# EAGLE design DDS-Gen (EAGLE 8.0.2)
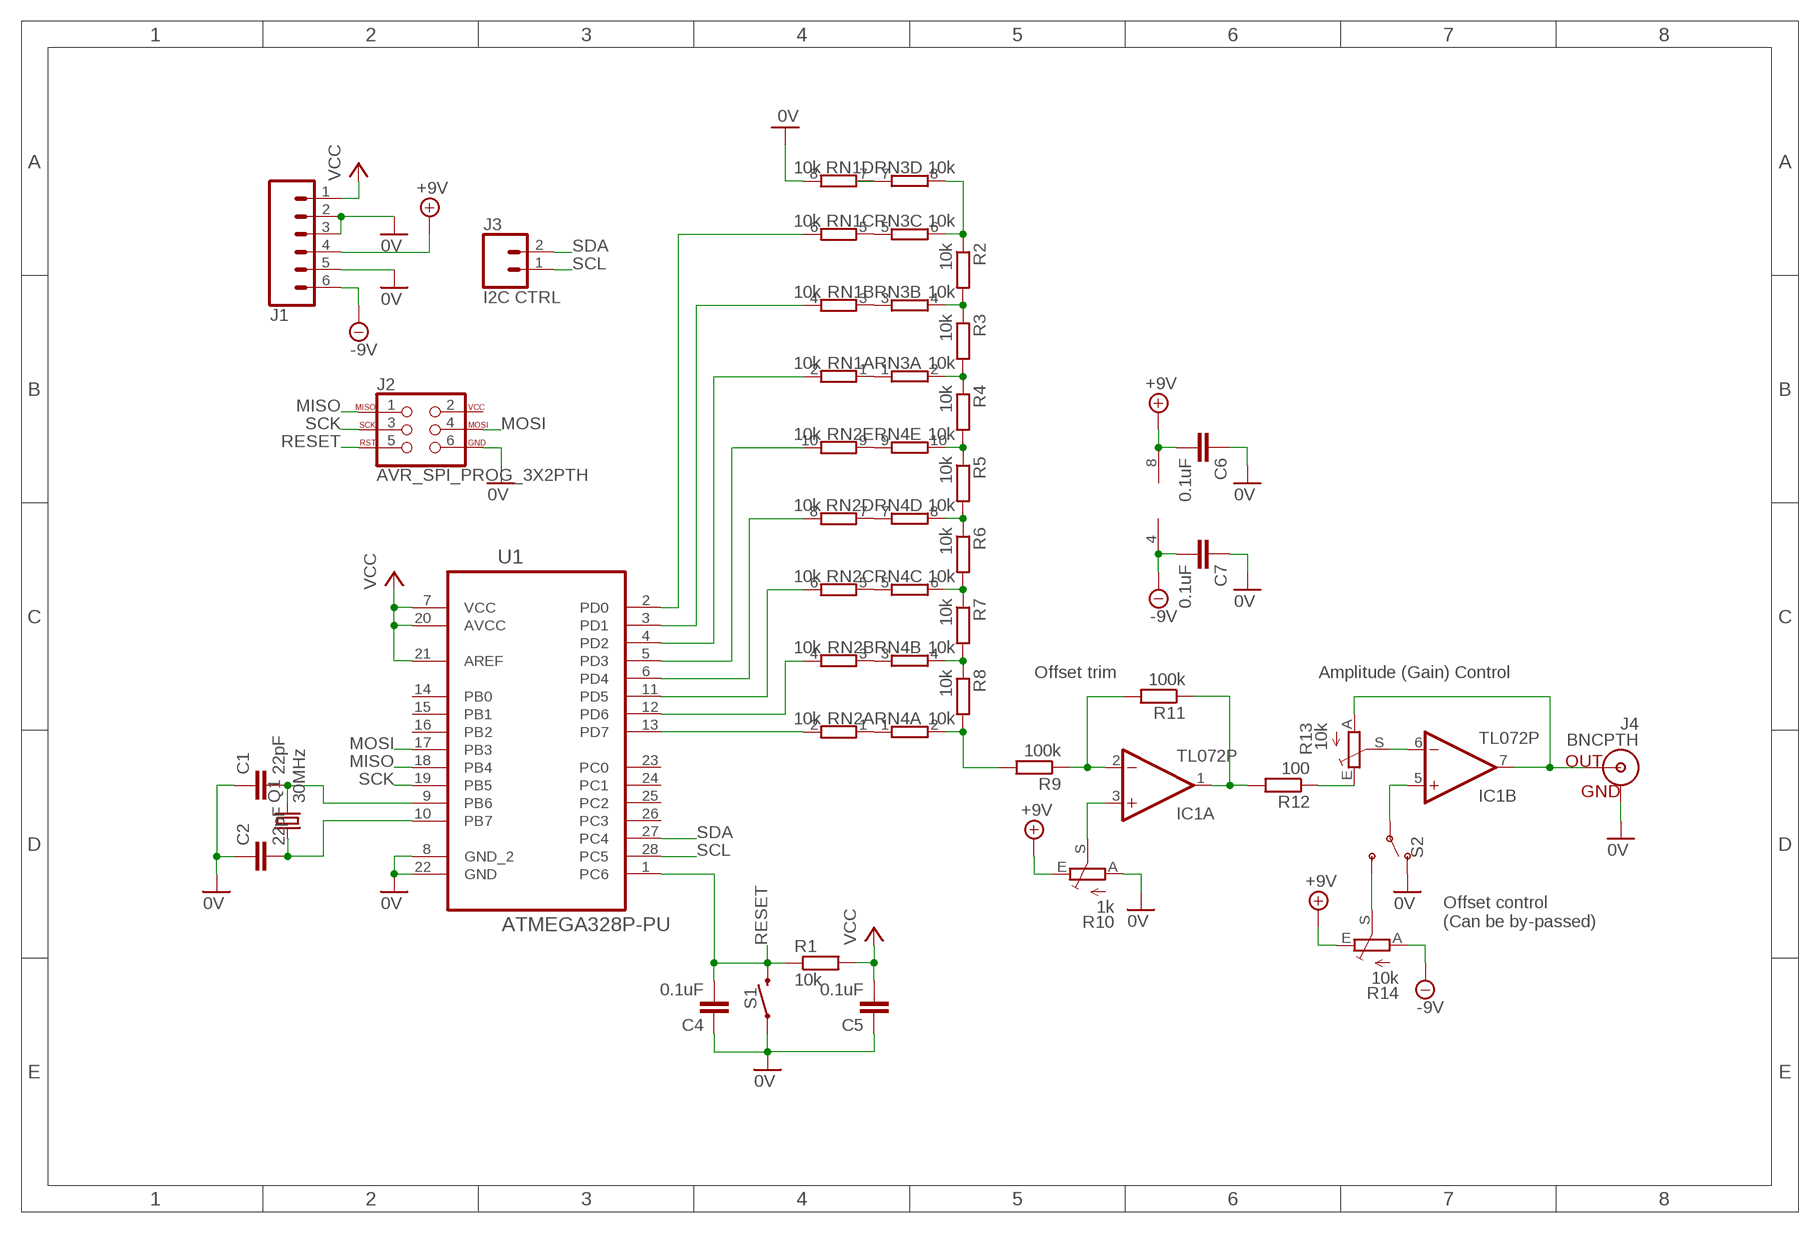
[diagram p0: schematic, sheet 1]

## Parts
C1  22pF  C-EU025-025X050  [C025-025X050]
C2  22pF  C-EU025-025X050  [C025-025X050]
C4  0.1uF  C-EU025-025X050  [C025-025X050]
C5  0.1uF  C-EU025-025X050  [C025-025X050]
C6  0.1uF  C-EU025-025X050  [C025-025X050]
C7  0.1uF  C-EU025-025X050  [C025-025X050]
IC1  TL072P  [DIL08]
J1  CONN_06POLAR  [MOLEX-1X6]
J2  AVR_SPI_PROG_3X2PTH  [2X3]
J3  I2C CTRL  CONN_02POLAR  [MOLEX-1X2]
J4  BNCPTH  [BNC]
Q1  30MHz  CRYSTALHC49S  [HC49/S]
R1  10k  R-EU_0204/5  [0204/5]
R2  10k  R-EU_0204/5  [0204/5]
R3  10k  R-EU_0204/5  [0204/5]
R4  10k  R-EU_0204/5  [0204/5]
R5  10k  R-EU_0204/5  [0204/5]
R6  10k  R-EU_0204/5  [0204/5]
R7  10k  R-EU_0204/5  [0204/5]
R8  10k  R-EU_0204/5  [0204/5]
R9  100k  R-EU_0204/5  [0204/5]
R10  1k  TRIM_EU-S64W  [S64W]
R11  100k  R-EU_0204/2V  [0204V]
R12  100  R-EU_0207/12  [0207/12]
R13  10k  TRIM_EU-CIP20C-6MM  [CIP20C-6MM]
R14  10k  TRIM_EU-CIP20C-6MM  [CIP20C-6MM]
RN1  10k  E5R  [SIL10]
RN2  10k  E5R  [SIL10]
RN3  10k  E5R  [SIL10]
RN4  10k  E5R  [SIL10]
S1  MOMENTARY-SWITCH-SPST-PTH-6.0MM  [TACTILE_SWITCH_PTH_6.0MM]
S2  SWITCH-SPDT-PTH-11.6X4.0MM  [SWITCH_SPDT_PTH_11.6X4.0MM]
U1  ATMEGA328P-PU  [DIP254P762X457-28]

## Nets
0V: C1.1 C2.1 C4.1 C5.1 C6.1 C7.1 J1.2 J1.3 J1.5 J2.6 J4.GND R10.A RN1.8 S1.1 S2.1(O) U1.8(GND_2) U1.22(GND)
+9V: C6.2 IC1.8(P:V+) J1.4 R10.E R14.E
-9V: C7.2 IC1.4(P:V-) J1.6 R14.A
MISO: J2.1 U1.18(PB4)
MOSI: J2.4 U1.17(PB3)
N$1: C2.2 Q1.1 U1.10(PB7)
N$2: C1.2 Q1.2 U1.9(PB6)
N$3: IC1.3(A:+IN) R10.S
N$4: IC1.2(A:-IN) R9.1 R11.2
N$5: RN2.2 U1.13(PD7)
N$6: RN2.4 U1.12(PD6)
N$7: RN2.6 U1.11(PD5)
N$8: RN2.8 U1.6(PD4)
N$9: RN2.10 U1.5(PD3)
N$10: RN1.2 U1.4(PD2)
N$11: RN1.4 U1.3(PD1)
N$12: RN1.6 U1.2(PD0)
N$13: IC1.5(B:+IN) S2.2(P)
N$15: R14.S S2.3(S)
N$16: R12.1 R13.E
N$21: IC1.1(A:OUT) R11.1 R12.2
N$22: IC1.6(B:-IN) R13.S
N$23: IC1.7(B:OUT) J4.S(OUT) R13.A
N$25: RN2.1 RN4.1
N$26: RN2.3 RN4.3
N$27: RN2.5 RN4.5
N$28: RN2.7 RN4.7
N$29: RN2.9 RN4.9
N$30: RN1.1 RN3.1
N$31: RN1.3 RN3.3
N$32: RN1.5 RN3.5
N$33: RN1.7 RN3.7
N$34: R2.1 RN3.6 RN3.8
N$35: R2.2 R3.1 RN3.4
N$36: R3.2 R4.1 RN3.2
N$37: R4.2 R5.1 RN4.10
N$38: R5.2 R6.1 RN4.8
N$39: R6.2 R7.1 RN4.6
N$40: R7.2 R8.1 RN4.4
N$41: R8.2 R9.2 RN4.2
RESET: C4.2 J2.5 R1.1 S1.3 U1.1(PC6)
SCK: J2.3 U1.19(PB5)
SCL: J3.1 U1.28(PC5)
SDA: J3.2 U1.27(PC4)
VCC: C5.2 J1.1 R1.2 U1.7(VCC) U1.20(AVCC) U1.21(AREF)
Unconnected: J2.2 RN1.9 RN1.10 RN3.9 RN3.10 U1.14(PB0) U1.15(PB1) U1.16(PB2) U1.23(PC0) U1.24(PC1) U1.25(PC2) U1.26(PC3)

## Notes on the sheet
- Offset trim | Amplitude (Gain) Control
- Offset control
  (Can be by-passed)

## Library data of the parts
C1 C2 C4-C7 = rcl:C-EU: CAPACITOR, European symbol
IC1 = linear:TL072: OP AMP
J1 = SparkFun-Connectors:CONN_06: Multi connection point. Often used as Generic Header-pin footprint for 0.1 inch spaced/style header connections On any of the 0.1 inch spaced packages, you can populate with these: Break Away Headers - Straight <https://www.sparkfun.com/products/116> (PRT-00116) Break Away Male Headers - Right Angle <https://www.sparkfun.com/products/553> (PRT-00553) Female Headers <https://www.sparkfun.com/products/115> (PRT-00115) Break Away Headers - Machine Pin <https://www.sparkfun.com/products/117> (PRT-00117) Break Away Female Headers - Swiss Machine Pin <https://www.sparkfun.com/products/743> (PRT-00743) Arduino Stackable Header - 6 Pin <https://www.sparkfun.com/products/9280> (PRT-09280) For SCREWTERMINALS and SPRING TERMINALS visit here: Screw Terimnals on SparkFun.com <https://www.sparkfun.com/search/results?term=Screw+Terminals> (5mm/3.5mm/2.54mm spacing) This device is also useful as a general connection point to wire up your design to another part of your project. Our various solder wires solder well into these plated through hole pads. Hook-Up Wire - Assortment (Stranded, 22 AWG) <https://www.sparkfun.com/products/11375> (PRT-11375) Hook-Up Wire - Assortment (Solid Core, 22 AWG) <https://www.sparkfun.com/products/11367> (PRT-11367) View the entire wire category on our website here <https://www.sparkfun.com/categories/141>
J2 = SparkFun-Connectors:AVR_SPI_PROG_3X2: AVR ISP 6 Pin This is the reduced ISP connector for AVR programming. Common on Arduino. This footprint will take up less PCB space and can be used with a 10-pin to 6-pin adapter such as SKU: BOB-08508 **Special note about "TEST_POINT" package. The stop mask is on the top side, so if you want your programming test points to be on the bottom of your board, make sure to place this package on the bottom side of the board. This also ensure that the orientation to program from the bottom side will be correct. SparkFun Products: SparkFun ISP Pogo Adapter <https://www.sparkfun.com/products/11591> - NS Tiny AVR Programmer <https://www.sparkfun.com/products/11801> -PTH
J3 = SparkFun-Connectors:CONN_02: Multi connection point. Often used as Generic Header-pin footprint for 0.1 inch spaced/style header connections On any of the 0.1 inch spaced packages, you can populate with these: Break Away Headers - Straight <https://www.sparkfun.com/products/116> (PRT-00116) Break Away Male Headers - Right Angle <https://www.sparkfun.com/products/553> (PRT-00553) Female Headers <https://www.sparkfun.com/products/115> (PRT-00115) Break Away Headers - Machine Pin <https://www.sparkfun.com/products/117> (PRT-00117) Break Away Female Headers - Swiss Machine Pin <https://www.sparkfun.com/products/743> (PRT-00743) For SCREWTERMINALS and SPRING TERMINALS visit here: Screw Terimnals on SparkFun.com <https://www.sparkfun.com/search/results?term=Screw+Terminals> (5mm/3.5mm/2.54mm spacing) This device is also useful as a general connection point to wire up your design to another part of your project. Our various solder wires solder well into these plated through hole pads. Hook-Up Wire - Assortment (Stranded, 22 AWG) <https://www.sparkfun.com/products/11375> (PRT-11375) Hook-Up Wire - Assortment (Solid Core, 22 AWG) <https://www.sparkfun.com/products/11367> (PRT-11367) View the entire wire category on our website here <https://www.sparkfun.com/categories/141> Special notes: Molex polarized connector foot print use with: PRT-08233 with associated crimp pins and housings. 2.54_SCREWTERM for use with PRT-10571. 3.5mm Screw Terminal footprints for PRT-08084 5mm Screw Terminal footprints for use with PRT-08432; SF_ID: PRT-09918
J4 = SparkFun-Connectors:BNC: BNC Right Angle Connector Mouser Part# 5227161 SparkFun Products: BNC Connector - Right Angle <https://www.sparkfun.com/products/10550>; PROD_ID: LPA-12729; SF_ID: PRT-10550
Q1 = crystal:CRYSTAL: CRYSTAL; OC_FARNELL: 1667008; OC_NEWARK: unknown
R1-R9 R11 R12 = rcl:R-EU_: RESISTOR, European symbol
R10 R13 R14 = pot:TRIM_EU-: POTENTIOMETER
RN1-RN4 = resistor-sil:E5R: SIL RESISTOR; OC_FARNELL: unknown; OC_NEWARK: unknown
S1 = SparkFun-Switches:MOMENTARY-SWITCH-SPST: Momentary Switch (Pushbutton) - SPST Normally-open (NO) SPST momentary switches (buttons, pushbuttons). Variants PTH-12MM - 12mm square, through-hole Momentary Pushbutton Switch - 12mm Square <https://www.sparkfun.com/products/9190> (COM-09190) PTH-6.0MM, PTH-6.0MM-KIT - 6.0mm square, through-hole Mini Pushbutton Switch <https://www.sparkfun.com/products/97> (COM-00097) KIT package intended for soldering kit's - only one side of pads' copper is exposed. PTH-RIGHT-ANGLE-KIT - Right-angle, through-hole Right Angle Tactile Button <https://www.sparkfun.com/products/10791> - Used on SparkFun BigTime Watch Kit <https://www.sparkfun.com/products/11734> SMD-12MM - 12mm square, surface-mount Tactile Button - SMD (12mm) <https://www.sparkfun.com/products/12993> (COM-12993) Used on SparkFun PicoBoard <https://www.sparkfun.com/products/11888> SMD-4.5MM - 4.5mm Square Trackball Switch Used on SparkFun Blackberry Trackballer Breakout <https://www.sparkfun.com/products/13169> SMD-4.6MMX2.8MM - 4.60mm x 2.80mm, surface mount Used on SparkFun SAMD21 Mini Breakout <https://www.sparkfun.com/products/13664> SMD-5.2MM, SMD-5.2-REDUNDANT - 5.2mm square, surface-mount Mini Pushbutton Switch - SMD <https://www.sparkfun.com/products/8720> (COM-08720) Used on Arduino Pro Mini <https://www.sparkfun.com/products/11114> REDUNDANT package connects both switch circuits together SMD-6.0X3.5MM - 6.0 x 3.5mm, surface mount Momentary Reset Switch SMD <https://www.sparkfun.com/products/8229> (COM-08229) SMD-6.2MM-TALL - 6.2mm square, surface mount Tactile Button - SMD (6mm) <https://www.sparkfun.com/products/12992> Used on SparkFun Digital Sandbox <https://www.sparkfun.com/products/12651> SMD-RIGHT-ANGLE - Right-angle, surface mount Used on SparkFun Block for Intel® Edison - Arduino <https://www.sparkfun.com/products/13036>; PROD_ID: SWCH-08441; SF_SKU: COM-00097
S2 = SparkFun-Switches:SWITCH-SPDT: Single Pole, Double Throw (SPDT) Switch Single-pole, double-throw (SPDT) switch. Variant Overview SMD-AYZ0202 Surface Mount DPDT Switch <https://www.sparkfun.com/products/597> (COM-00597) Used on e.g. LilyPad Arduino USB - ATmega32U4 Board <https://www.sparkfun.com/products/12049> PTH-11.6X4.0MM SPDT Mini Power Switch <https://www.sparkfun.com/products/102> (COM-00102) Used on e.g. SparkFun Simon Says - Through-Hole Soldering Kit <https://www.sparkfun.com/products/10547> (KIT-10547) PTH-11.6X4.0MM-KIT KIT version of SPDT Mini Power Switch - Simplifies soldering by removing tStop of switch pins - only one side can be soldered. PTH-11.6X4.0MM-LOCK LOCK version of SPDT Mini Power Switch - Offset pins hold switch in place for easier soldering. SMD-RIGHT-ANGLE Surface Mount Right Angle Switch <https://www.sparkfun.com/products/10860> (COM-10860) Used on e.g. SparkFun ESP8266 Thing <https://www.sparkfun.com/products/13231>; PROD_ID: SWCH-08261; SF_SKU: COM-00102
U1 = Atmel_By_element14_Batch_1-00:ATMEGA328P-PU: 8-bit Microcontroller with In-System Programmable Flash; MPN: ATMEGA328P-PU; OC_FARNELL: 1715487; OC_NEWARK: 15R0268; PACKAGE: PDIP-28; SUPPLIER: Atmel

## Board
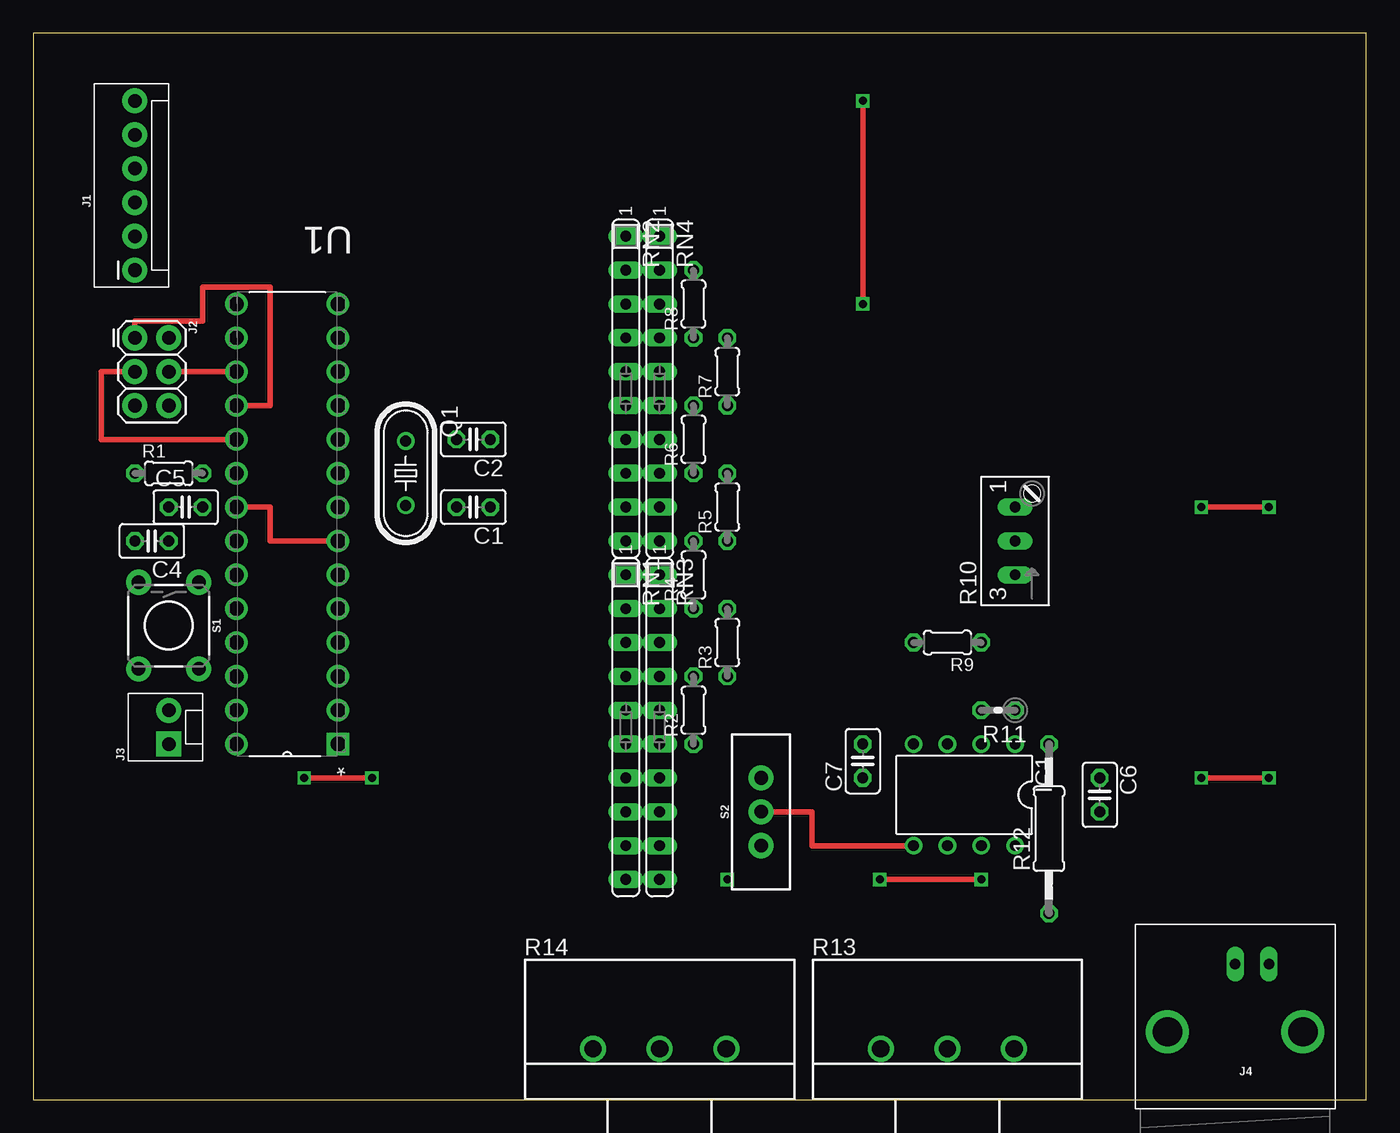
[diagram p1: board, top side]
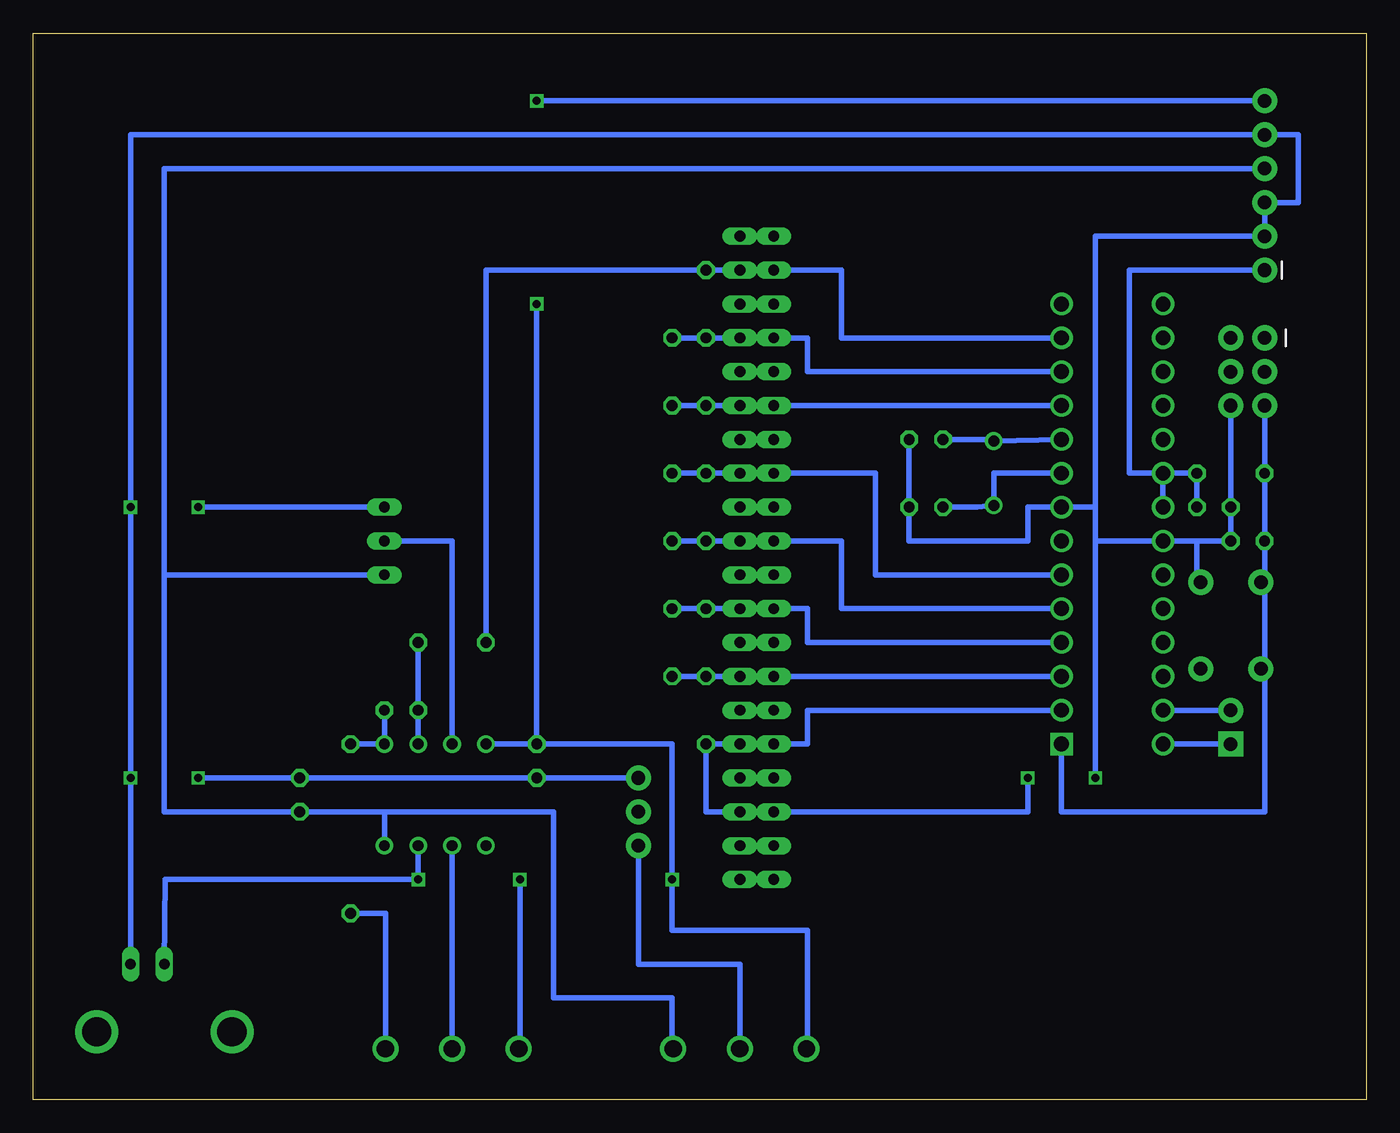
[diagram p2: board, bottom side, seen from below]

Size 100 x 80 mm. Coordinates in mm from the lower left corner, seen from the top.
Outline: 0,0 100,0 100,80 0,80 0,0
Copper layers (1*16): Top 0.035mm / dielectric 1.5mm / Bottom 0.035mm
Design rules "default": minimum track width 10mil, minimum drill 24mil, track to track 8mil, track to pad 8mil, pad to pad 8mil, via to via 8mil, smd to smd 8mil, copper to edge 40mil, drill to drill 8mil, minimum pad ring 10mil, minimum via ring 8mil, stop-mask expansion 4mil, vias tented up to drill 0mil, thermal gap 10mil

### Footprints (pad centres in the part's own frame; a part is rotated, then mirrored left to right if it is on the bottom)
C025-025X050 = drill 0.813 octagon: 1 -1.27,0; 2 1.27,0
DIL08 = drill 0.813 pad 1.27: 1 -3.81,-3.81; 2 -1.27,-3.81; 3 1.27,-3.81; 4 3.81,-3.81; 5 3.81,3.81; 6 1.27,3.81; 7 -1.27,3.81; 8 -3.81,3.81
MOLEX-1X6 = drill 1.016 pad 1.88: 1 0,0; 2 2.54,0; 3 5.08,0; 4 7.62,0; 5 10.16,0; 6 12.7,0
2X3 = drill 1.016 pad 1.88: 1 0,0; 2 0,2.54; 3 2.54,0; 4 2.54,2.54; 5 5.08,0; 6 5.08,2.54
MOLEX-1X2 = drill 1.016 pad 1.88 square: 1 0,0 | drill 1.016 pad 1.88: 2 2.54,0
BNC = drill 2.2: 3 -5.08,5.08; 4 5.08,5.08 | drill 0.8 long: GND -2.54,0; S 0,0
HC49/S = drill 0.813: 1 -2.413,0; 2 2.413,0
0204/5 = drill 0.813 octagon: 1 -2.54,0; 2 2.54,0
S64W = drill 0.813 long: A 2.54,1.27; E -2.54,1.27; S 0,1.27
0204V = drill 0.813 octagon: 1 -1.27,0; 2 1.27,0
0207/12 = drill 0.813 octagon: 1 -6.35,0; 2 6.35,0
CIP20C-6MM = drill 1.3 pad 1.93: A -5,0; E 5,0; S 0,0
SIL10 = drill 0.813 long: 1 -11.43,0; 2 -8.89,0; 3 -6.35,0; 4 -3.81,0; 5 -1.27,0; 6 1.27,0; 7 3.81,0; 8 6.35,0; 9 8.89,0; 10 11.43,0
TACTILE_SWITCH_PTH_6.0MM = drill 1.016 pad 1.88: 1 -3.251,2.261; 2 3.251,2.261; 3 -3.251,-2.261; 4 3.251,-2.261
SWITCH_SPDT_PTH_11.6X4.0MM = drill 1.016 pad 1.88: 1 0,2.54; 2 0,0; 3 0,-2.54
DIP254P762X457-28 = drill 1.118 square: 1 -7.62,33.02 | drill 1.118: 2 -7.62,30.48; 3 -7.62,27.94; 4 -7.62,25.4; 5 -7.62,22.86; 6 -7.62,20.32; 7 -7.62,17.78; 8 -7.62,15.24; 9 -7.62,12.7; 10 -7.62,10.16; 11 -7.62,7.62; 12 -7.62,5.08; 13 -7.62,2.54; 14 -7.62,0; 15 0,0; 16 0,2.54; 17 0,5.08; 18 0,7.62; 19 0,10.16; 20 0,12.7; 21 0,15.24; 22 0,17.78; 23 0,20.32; 24 0,22.86; 25 0,25.4; 26 0,27.94; 27 0,30.48; 28 0,33.02

### Placement (x,y rotation side)
C1  33.02,44.45 180 top
C2  33.02,49.53 180 top
C4  8.89,41.91 180 top
C5  11.43,44.45 0 top
C6  80.01,22.86 270 top
C7  62.23,25.4 90 top
IC1  69.85,22.86 180 top
J1  7.62,62.23 90 top
J2  7.62,57.15 270 top
J3  10.16,26.67 90 top
J4  90.17,10.16 180 top
Q1  27.94,46.99 270 top
R1  10.16,46.99 0 top
R2  49.53,29.21 90 top
R3  52.07,34.29 90 top
R4  49.53,39.37 90 top
R5  52.07,44.45 90 top
R6  49.53,49.53 90 top
R7  52.07,54.61 90 top
R8  49.53,59.69 90 top
R9  68.58,34.29 180 top
R10  74.93,41.91 90 top
R11  72.39,29.21 180 top
R12  76.2,20.32 90 top
R13  68.58,3.81 0 top
R14  46.99,3.81 0 top
RN1  44.45,27.94 270 top
RN2  44.45,53.34 270 top
RN3  46.99,27.94 270 top
RN4  46.99,53.34 270 top
S1  10.16,35.56 270 top
S2  54.61,21.59 0 top
U1  15.24,59.69 180 top

### Tracks (layer width: path | path; a pad name or v marks a point on that pad's centre or on a via)
0V  (via drill 0.6)
  Top 0.406: v92.71,24.13 v87.63,24.13 | v87.63,44.45 v92.71,44.45 | v20.32,24.13 v25.4,24.13
  Bottom 0.406: 20.32,44.45 U1.8 25.4,44.45 25.4,41.91 34.29,41.91 C1.1 C2.1 | S2.1 C7.1 C6.1 v87.63,24.13 | J4.GND v92.71,24.13 v92.71,44.45 92.71,72.39 J1.5 5.08,72.39 5.08,67.31 J1.3 J1.2 20.32,64.77 20.32,44.45 | R10.A v87.63,44.45 | 20.32,44.45 20.32,41.91 | 20.32,41.91 U1.22 12.7,41.91 | C4.1 J2.6 | 12.7,41.91 C4.1 | S1.1 12.7,38.81 12.7,41.91 | C5.1 C4.1 | 20.32,41.91 v20.32,24.13 | RN1.8 25.4,21.59 v25.4,24.13
+9V
  Bottom 0.406: R14.E 52.07,3.81 52.07,7.62 60.96,7.62 60.96,21.59 73.66,21.59 | IC1.8 73.66,21.59 | 73.66,21.59 C6.2 90.17,21.59 90.17,39.37 | J1.4 90.17,69.85 90.17,39.37 | 90.17,39.37 R10.E
-9V  (via drill 0.6)
  Top 0.406: v62.23,59.69 v62.23,74.93
  Bottom 0.406: R14.A 41.91,3.81 41.91,12.7 52.07,12.7 v52.07,16.51 52.07,26.67 C7.2 | C7.2 IC1.4 | C7.2 v62.23,59.69 | J1.6 v62.23,74.93
MISO
  Top 0.406: U1.18 17.78,52.07 17.78,60.96 12.7,60.96 12.7,58.42 7.62,58.42 J2.1
MOSI
  Top 0.406: J2.4 U1.17
N$1
  Bottom 0.406: U1.10 Q1.1 27.94,49.53 C2.2
N$2
  Bottom 0.406: U1.9 27.94,46.99 Q1.2 29.21,44.45 C1.2
N$3
  Bottom 0.406: IC1.3 68.58,41.91 R10.S
N$4
  Bottom 0.406: IC1.2 R11.2 R9.1
N$5
  Bottom 0.406: U1.13 39.37,57.15 39.37,62.23 RN2.2
N$6
  Bottom 0.406: U1.12 41.91,54.61 41.91,57.15 RN2.4
N$7
  Bottom 0.406: U1.11 RN2.6
N$8
  Bottom 0.406: U1.6 36.83,39.37 36.83,46.99 RN2.8
N$9
  Bottom 0.406: RN2.10 39.37,41.91 39.37,36.83 U1.5
N$10
  Bottom 0.406: U1.4 41.91,34.29 41.91,36.83 RN1.2
N$11
  Bottom 0.406: U1.3 RN1.4
N$12
  Bottom 0.406: U1.2 41.91,29.21 41.91,26.67 RN1.6
N$13
  Top 0.406: IC1.5 58.42,19.05 58.42,21.59 S2.2
N$15
  Bottom 0.406: R14.S 46.99,10.16 54.61,10.16 S2.3
N$16
  Bottom 0.406: R12.1 73.58,13.97 R13.E
N$21
  Bottom 0.406: R11.1 IC1.1 R12.2
N$22
  Bottom 0.406: IC1.6 R13.S
N$23  (via drill 0.6)
  Top 0.406: v63.5,16.51 v71.12,16.51
  Bottom 0.406: IC1.7 v71.12,16.51 90.09,16.51 J4.S | R13.A 63.5,3.81 v63.5,16.51
N$25
  Bottom 0.406: RN4.1 RN2.1
N$26
  Bottom 0.406: RN4.3 RN2.3
N$27
  Bottom 0.406: RN4.5 RN2.5
N$28
  Bottom 0.406: RN4.7 RN2.7
N$29
  Bottom 0.406: RN4.9 RN2.9
N$30
  Bottom 0.406: RN3.1 RN1.1
N$31
  Bottom 0.406: RN3.3 RN1.3
N$32
  Bottom 0.406: RN1.5 RN3.5
N$33
  Bottom 0.406: RN3.7 RN1.7
N$34
  Bottom 0.406: RN3.8 49.53,21.59 R2.1 RN3.6
N$35
  Bottom 0.406: R2.2 R3.1 RN3.4
N$36
  Bottom 0.406: RN3.2 R3.2 R4.1
N$37
  Bottom 0.406: R4.2 R5.1 RN4.10
N$38
  Bottom 0.406: RN4.8 R5.2 R6.1
N$39
  Bottom 0.406: R6.2 R7.1 RN4.6
N$40
  Bottom 0.406: RN4.4 R7.2 R8.1
N$41
  Bottom 0.406: RN4.2 R8.2 66.04,62.23 R9.2
RESET
  Bottom 0.406: C4.2 7.62,38.81 | C4.2 J2.5 | 7.62,38.81 7.62,21.59 22.86,21.59 U1.1 | S1.3 7.62,38.81 | R1.1 C4.2
SCK
  Top 0.406: J2.3 5.08,54.61 5.08,49.53 U1.19
SCL
  Bottom 0.406: U1.28 J3.1
SDA
  Bottom 0.406: J3.2 U1.27
VCC
  Top 0.406: U1.21 17.78,44.45 17.78,41.91 U1.7
  Bottom 0.406: U1.21 U1.20 | C5.2 R1.2 U1.20 | U1.20 17.78,46.99 17.78,62.23 J1.1